# Altium schematic sheet AnalogConditioning.SchDoc: Current and DC Link Analog Conditioning
size A4; Author: Adam Mizerkiewicz; CompanyName: Saule S.A.; DrawnBy: Adam Mizerkiewicz; Organization: Saule S.A.; Address1: Ul. Duńska 11; Address2: 54-427 Wrocław; DocumentNumber: 23; SheetNumber: 7; SheetTotal: 18
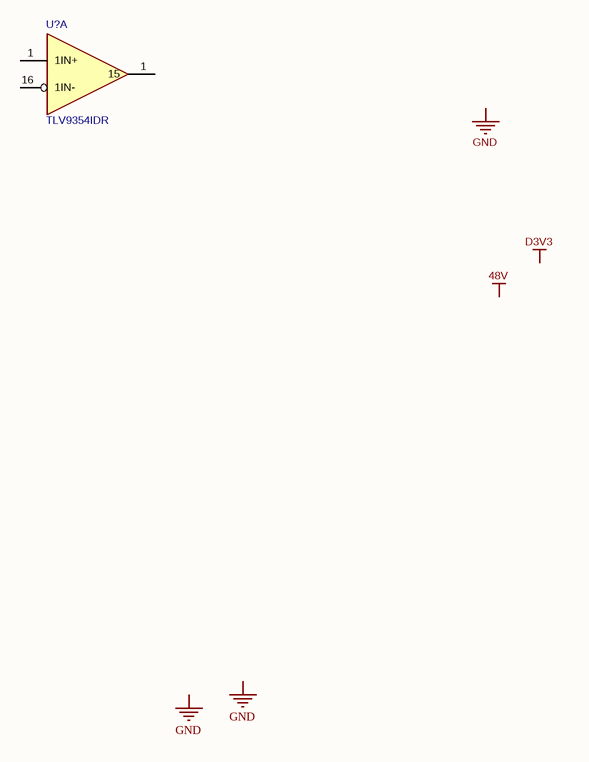
[diagram p0: AnalogConditioning.SchDoc]

## Parts
U?  TLV9354IDR  [VQFN16]  (part A of 5)

## Nets

Not connected (* = marked no-connect by the designer): U? 1(15) 16(1IN-)

## Notes on the sheet
- Labels drawn without touching a wire or pin: 48V, D3V3, GND
- Title
- Size:
- Date:
- A4
- Number:
- Time:
- Revision:
- Sheet
- of
- File:

## Library data of the parts
U? = TSZ124IQ4T: TSZ124 Series 5.5V 400 kHz Rail to Rail SMT Operational Amplifier - TSSOP-14; Manufacturer: STMicroelectronics; Bandwidth: 400kHz; Common Mode Rejection Ratio: 115dB; Input Bias Current: 200pA; Input Offset Voltage (Vos): 8µV; Max Supply Current: 40µA; Max Supply Voltage: 6V; Min Supply Voltage: 1.8V; Nominal Supply Current: 31µA; Number of Channels: 4; Operating Supply Voltage: 3.3V; Output Current: 17mA; Output Current per Channel: 18mA; Slew Rate: 0.19V/µs; Voltage Gain: 135dB; Supplier 1: DigiKey; Supplier Part Number 1: 497-14337-1-ND; Supplier: DigiKey; Supplier Part Number: 497-14337-1-ND; Manufacturer Part Number: TSZ124IQ4T; RoHS: Compliant; Category: Amplifiers - Op Amps, Buffer, Instrumentation; Stock: 10565; Pricing: 1=1,86, 10=1,367, 25=1,2444, 100=1,1092, 250=1,0448, 500=1,00596, 1000=0,97398 (USD); Case/Package: QFN; China RoHS: Compliant; Gain Bandwidth Product: 400kHz; Height - Seated (Max): 1mm; Length: 3mm; Lifecycle Status: Production; Max Operating Temperature: 125°C; Min Operating Temperature: -40°C; Mounting Technology: Surface Mount; Number of Circuits: 4; Pins: 16; Number of Terminals: 4; Operating Supply Current: 31µA; Packaging: Tape and Reel; REACH SVHC: Yes; Schedule B: 8542330000, 8542330000|8542330000|8542330000|8542330000|8542330000; Terminal Pitch: 500µm; Unity Gain Bandwidth Product: 400kHz; Width: 3mm; ComponentLink1URL: https://datasheet.octopart.com:443/TSZ124IQ4T-STMicroelectronics-datasheet-62337710.pdf?src-supplier=Future+Electronics; ComponentLink1Description: https://datasheet.octopart.com:443/TSZ124IQ4T-STMicroelectronics-datasheet-62337710.pdf?src-supplier=Future+Electronics; ComponentLink2URL: https://datasheet.octopart.com:443/TSZ124IQ4T-STMicroelectronics-datasheet-16350222.pdf?src-supplier=STMicroelectronics; ComponentLink2Description: https://datasheet.octopart.com:443/TSZ124IQ4T-STMicroelectronics-datasheet-16350222.pdf?src-supplier=STMicroelectronics; ComponentLink3URL: https://datasheet.octopart.com:443/TSZ124IQ4T-STMicroelectronics-datasheet-140259870.pdf?src-supplier=Farnell; ComponentLink3Description: https://datasheet.octopart.com:443/TSZ124IQ4T-STMicroelectronics-datasheet-140259870.pdf?src-supplier=Farnell; ComponentLink4URL: https://datasheet.octopart.com:443/TSZ124IQ4T-STMicroelectronics-datasheet-159009515.pdf?src-supplier=SHENGYU+ELECTRONICS; ComponentLink4Description: https://datasheet.octopart.com:443/TSZ124IQ4T-STMicroelectronics-datasheet-159009515.pdf?src-supplier=SHENGYU+ELECTRONICS; ComponentLink5URL: https://datasheet.octopart.com:443/TSZ124IQ4T-STMicroelectronics-datasheet-165583692.pdf?src-supplier=TME; ComponentLink5Description: https://datasheet.octopart.com:443/TSZ124IQ4T-STMicroelectronics-datasheet-165583692.pdf?src-supplier=TME